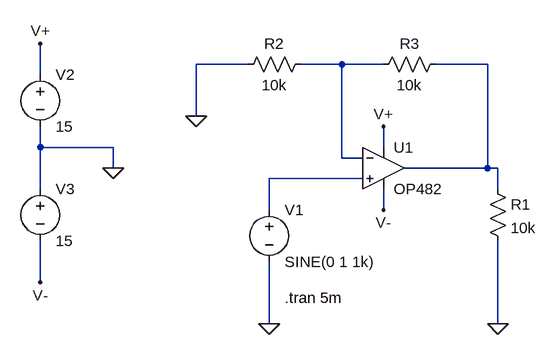
[diagram p0: schematic OP482.asc]
OP482.asc, the LTspice schematic file:
Version 4
SHEET 1 880 680
WIRE 48 -32 -32 -32
WIRE 192 -32 128 -32
WIRE 256 -32 192 -32
WIRE 416 -32 336 -32
WIRE -272 -16 -272 -64
WIRE -32 48 -32 -32
WIRE -272 96 -272 64
WIRE -160 96 -272 96
WIRE 256 96 256 64
WIRE 192 112 192 -32
WIRE 224 112 192 112
WIRE -160 128 -160 96
WIRE 416 128 416 -32
WIRE 416 128 288 128
WIRE 432 128 416 128
WIRE 224 144 80 144
WIRE -272 160 -272 96
WIRE 432 160 432 128
WIRE 80 192 80 144
WIRE 256 192 256 160
WIRE -272 304 -272 240
WIRE 80 368 80 272
WIRE 432 368 432 240
FLAG 256 64 V+
FLAG 256 192 V-
FLAG -32 48 0
FLAG 80 368 0
FLAG 432 368 0
FLAG -160 128 0
FLAG -272 -64 V+
FLAG -272 304 V-
SYMBOL OP482 256 64 R0
SYMATTR InstName U1
SYMBOL res 416 144 R0
SYMATTR InstName R1
SYMATTR Value 10k
SYMBOL voltage 80 176 R0
SYMATTR InstName V1
SYMATTR Value SINE(0 1 1k)
SYMBOL res 144 -48 R90
WINDOW 0 0 56 VBottom 2
WINDOW 3 32 56 VTop 2
SYMATTR InstName R2
SYMATTR Value 10k
SYMBOL res 352 -48 R90
WINDOW 0 0 56 VBottom 2
WINDOW 3 32 56 VTop 2
SYMATTR InstName R3
SYMATTR Value 10k
SYMBOL voltage -272 -32 R0
WINDOW 123 0 0 Left 0
WINDOW 39 0 0 Left 0
SYMATTR InstName V2
SYMATTR Value 15
SYMBOL voltage -272 144 R0
WINDOW 123 0 0 Left 0
WINDOW 39 0 0 Left 0
SYMATTR InstName V3
SYMATTR Value 15
TEXT 104 328 Left 2 !.tran 5m

The netlist it stands for:
* OP482.asc
* U1: OP482 (symbol OP482 not available, pins judged from their places): In+=N003 In-=N001 V+=V+ V-=V- OUT=N002
R1 N002 0 10k
V1 N003 0 SINE(0 1 1k)
R2 N001 0 10k
R3 N002 N001 10k
V2 V+ 0 15
V3 0 V- 15
.tran 5m
.backanno
.end